# EAGLE design SController-8833 (EAGLE 9.3.0)
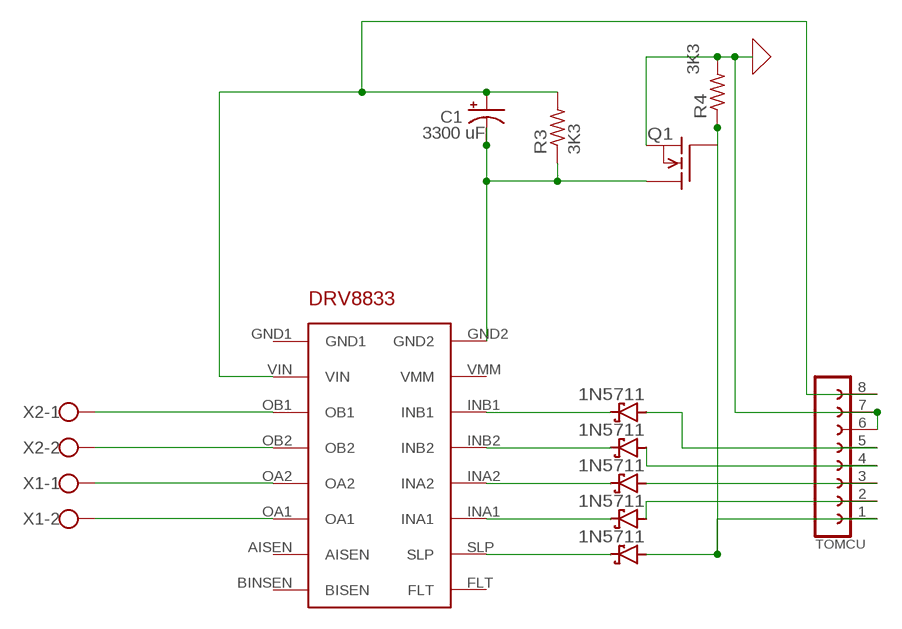
[diagram p0: schematic, sheet 1]

## Parts
""  POLOLU-DRV8833  [POLOLU-DRV8833]
C1  3300 uF  CPOL-USE5-10.5  [E5-10,5]
D1  1N5711  SCHOTTKY-DIODEF126Z12  [F126Z12]
D2  1N5711  SCHOTTKY-DIODEF126Z12  [F126Z12]
D3  1N5711  SCHOTTKY-DIODEF126Z12  [F126Z12]
D4  1N5711  SCHOTTKY-DIODEF126Z12  [F126Z12]
D5  1N5711  SCHOTTKY-DIODEF126Z12  [F126Z12]
Q1  SUP75N06-08  [TO220]
R3  3K3  R-US_0204/7  [0204/7]
R4  R-US_0204/7  [0204/7]
TOMCU  FE08-1  [FE08]
X1  W237-102  [W237-102]
X2  W237-102  [W237-102]

## Nets
A1: D5.A TOMCU.2
A2: D4.A TOMCU.3
B1: D1.A TOMCU.5
B2: D2.A TOMCU.4
GND: Q1.3(S) R4.2 TOMCU.6 TOMCU.7
IN-SLP: "".SLP D3.C
INA1: "".INA1 D5.C
INA2: "".INA2 D4.C
INB1: "".INB1 D1.C
INB2: "".INB2 D2.C
OA1: "".OA1 X1.2
OA2: "".OA2 X1.1
OB1: "".OB1 X2.1
OB2: "".OB2 X2.2
SLP: D3.A Q1.1(G) R4.1 TOMCU.1
VCC: "".VIN C1.+ R3.2 TOMCU.8
VGND: "".GND2 C1.- Q1.2(D) R3.1
Unconnected: "".AISEN "".BINSEN(BISEN) "".FLT "".GND1 "".VMM

## Library data of the parts
"" = Pololu_Driver_DRV8833:POLOLU-DRV8833: Created by: Deltarios DRV8833 pololu dual drive controller, PCB-ready device
C1 = rcl:CPOL-US: POLARIZED CAPACITOR, American symbol; SPICEPREFIX: C
D1-D5 = diode:SCHOTTKY-DIODE: Schottky Diode
Q1 = transistor-fet:SUP75N06-08: N-Channel Enhancement MOSFET 60V; 75A; 0,008Ohm
R3 = rcl:R-US_: RESISTOR, American symbol; SPICEPREFIX: R
R4 = rcl:R-US_: RESISTOR, American symbol; SPICEPREFIX: 3K3
TOMCU = con-lsta:FE08-1: FEMALE HEADER; OC_FARNELL: unknown; OC_NEWARK: unknown
X1 X2 = con-wago-500:W237-102: WAGO SCREW CLAMP; MPN: 237-102; OC_FARNELL: unknown; OC_NEWARK: 70K9898

## Net classes
0 default: width 1.016 mm, drill 1.016 mm, clearance 0.508 mm

## Board
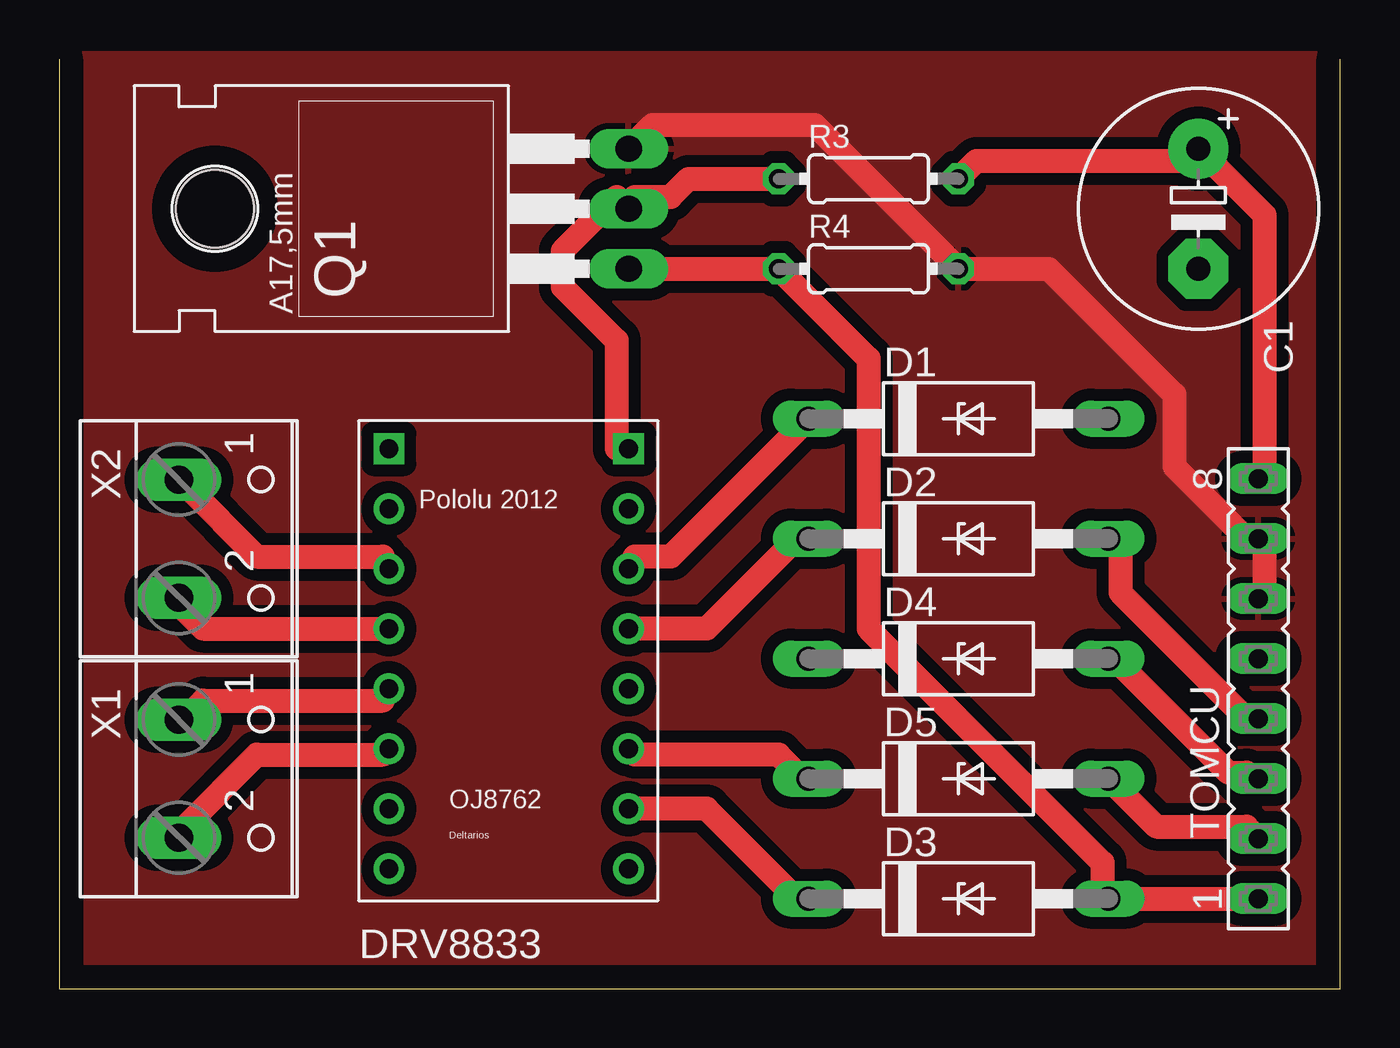
[diagram p1: board, top side]
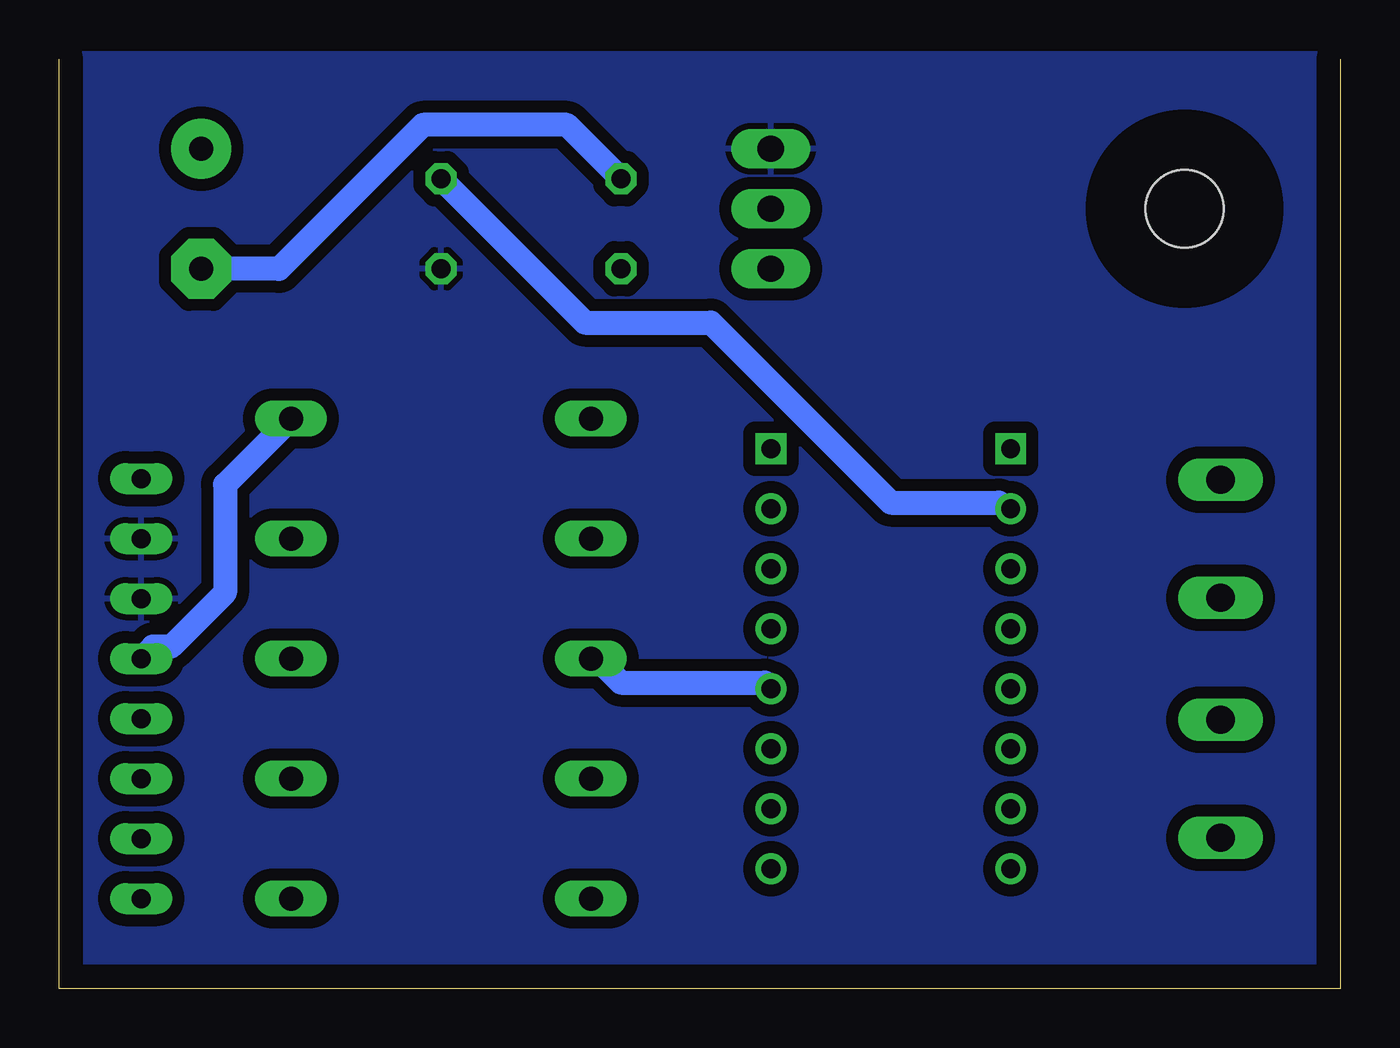
[diagram p2: board, bottom side, seen from below]

Size 54.28 x 39.36 mm. Coordinates in mm from the lower left corner, seen from the top.
Outline: 54.28,39.36 54.28,0 0,0 0,39.36
Copper layers (1*16): Top 0.035mm / dielectric 1.5mm / Bottom 0.035mm
Design rules "default": minimum track width 6mil, minimum drill 0.35mm, track to track 6mil, track to pad 6mil, pad to pad 6mil, via to via 6mil, smd to smd 6mil, copper to edge 40mil, drill to drill 6mil, minimum pad ring 10mil, minimum via ring 8mil, stop-mask expansion 4mil, vias tented up to drill 0mil, thermal gap 10mil

### Footprints (pad centres in the part's own frame; a part is rotated, then mirrored left to right if it is on the bottom)
POLOLU-DRV8833 = drill 0.8: AISEN -3.81,-7.62; BINSEN -3.81,-10.16; FLT 6.35,-10.16; INA1 6.35,-5.08; INA2 6.35,-2.54; INB1 6.35,2.54; INB2 6.35,0; OA1 -3.81,-5.08; OA2 -3.81,-2.54; OB1 -3.81,2.54; OB2 -3.81,0; SLP 6.35,-7.62; VIN -3.81,5.08; VMM 6.35,5.08 | drill 0.8 square: GND1 -3.81,7.62; GND2 6.35,7.62
E5-10,5 = drill 1.016 pad 2.54: + -2.54,0 | drill 1.016 pad 2.54 octagon: - 2.54,0
F126Z12 = drill 1.016 long: A 6.35,0; C -6.35,0
TO220 = drill 1.118 long: 1 -2.54,-6.35; 2 0,-6.35; 3 2.54,-6.35 | hole 3.302: 0,11.176
0204/7 = drill 0.813 octagon: 1 -3.81,0; 2 3.81,0
FE08 = drill 0.813 long: 1 -8.89,0; 2 -6.35,0; 3 -3.81,0; 4 -1.27,0; 5 1.27,0; 6 3.81,0; 7 6.35,0; 8 8.89,0
W237-102 = drill 1.194 long: 1 -2.5,-1.27; 2 2.5,-1.27

### Placement (x,y rotation side)
""  17.78,15.24 0 top
C1  48.26,33.02 270 top
D1  38.1,24.13 0 top
D2  38.1,19.05 0 top
D3  38.1,3.81 0 top
D4  38.1,13.97 0 top
D5  38.1,8.89 0 top
Q1  17.78,33.02 90 top
R3  34.29,34.29 0 top
R4  34.29,30.48 0 top
TOMCU  50.8,12.7 90 top
X1  6.35,8.89 270 top
X2  6.35,19.05 270 top

### Tracks (layer width: path | path; a pad name or v marks a point on that pad's centre or on a via)
A1
  Top 1.016: D5.A 46.48,6.86 50.29,6.86 TOMCU.2
A2
  Top 1.016: TOMCU.3 50.29,9.14 49.53,9.14 44.96,13.72 D4.A
B1
  Bottom 1.016: D1.A 47.24,21.34 47.24,16.76 49.53,14.48 50.29,14.48 TOMCU.5
B2
  Top 1.016: TOMCU.4 50.29,11.43 44.96,16.76 44.96,19.05 D2.A
GND
  Top 1.016: TOMCU.6 51.05,16.76 51.05,19.05 TOMCU.7 50.29,19.05 47.24,22.1 47.24,25.15 41.91,30.48 R4.2 32,36.58 25.15,36.58 Q1.3
  pour Top: 0,39.37 0,0 54.36,0 54.36,39.62 0,39.62
  pour Bottom: 0,39.62 0,0 54.36,0 54.36,39.62
IN-SLP
  Top 1.016: "".SLP 27.43,7.62 31.24,3.81 D3.C
INA1
  Top 1.016: "".INA1 24.38,9.91 30.48,9.91 31.24,9.14 D5.C
INA2
  Bottom 1.016: "".INA2 24.38,12.95 30.48,12.95 31.24,13.72 D4.C
INB1
  Top 1.016: D1.C 25.91,18.29 24.38,18.29 "".INB1
INB2
  Top 1.016: "".INB2 27.43,15.24 31.24,19.05 D2.C
OA1
  Top 1.016: "".OA1 13.72,9.91 8.38,9.91 5.33,6.86 X1.2
OA2
  Top 1.016: "".OA2 13.72,12.19 6.1,12.19 5.33,11.43 X1.1
OB1
  Top 1.016: "".OB1 13.72,18.29 8.38,18.29 5.33,21.34 X2.1
OB2
  Top 1.016: "".OB2 6.1,15.24 5.33,16 X2.2
SLP
  Top 1.016: TOMCU.1 D3.A 44.2,3.81 44.2,5.33 34.29,15.24 34.29,26.67 R4.1 Q1.1
VCC
  Top 1.016: TOMCU.8 51.05,22.1 51.05,32.77 C1.+ 48.01,35.05 38.86,35.05 R3.2
  Bottom 1.016: R3.2 32,28.19 26.67,28.19 19.05,20.57 14.48,20.57 "".VIN
VGND
  Top 1.016: "".GND2 23.62,22.86 23.62,27.43 21.34,29.72 21.34,31.24 23.62,33.53 Q1.2 24.38,33.53 25.91,33.53 26.67,34.29 R3.1
  Bottom 1.016: C1.- 44.96,30.48 38.86,36.58 32.77,36.58 R3.1